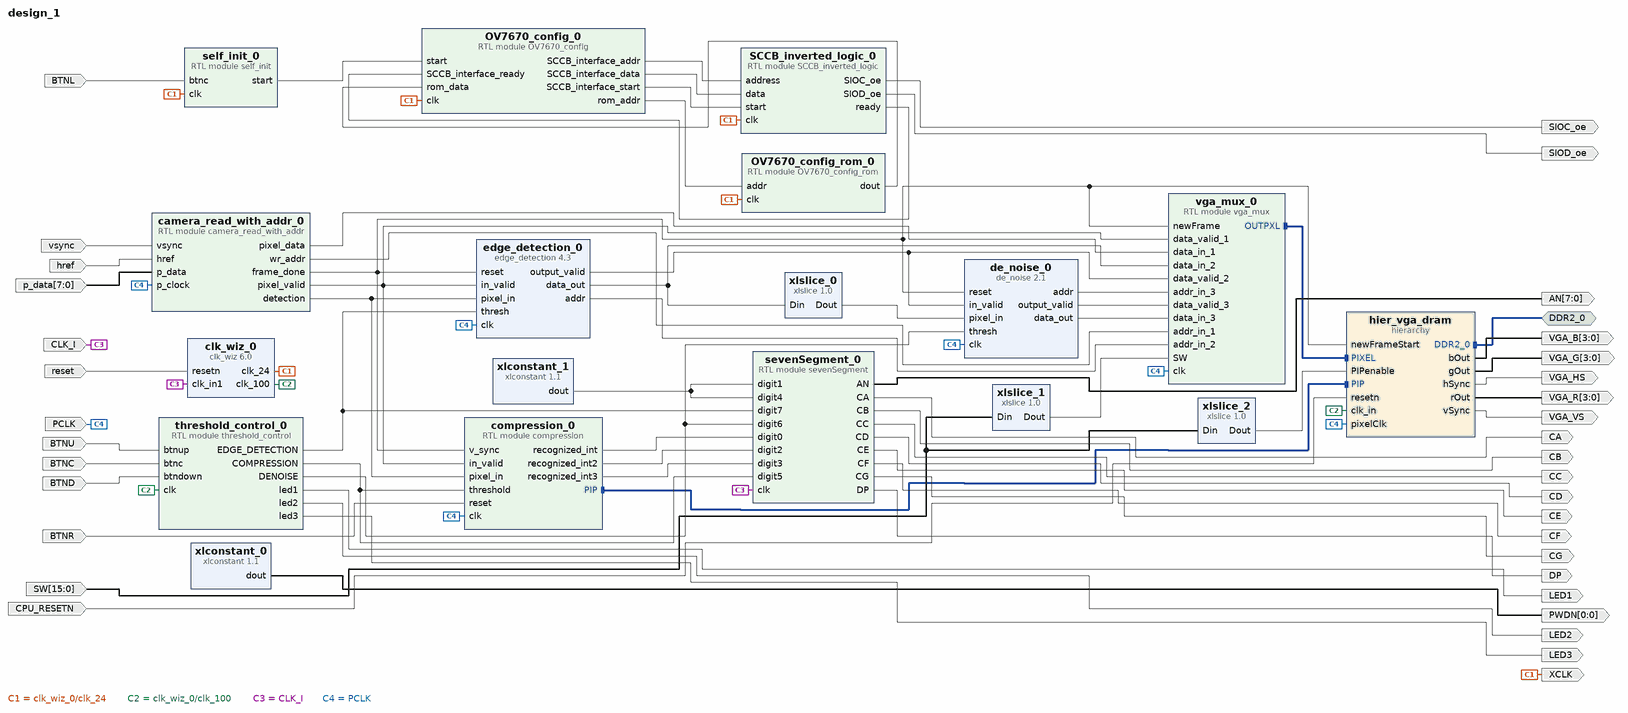
[diagram p0: block diagram of the top level]
# Vivado block design design_1, xc7a100tcsg324-1, Vivado 2018.3
create_bd_design design_1

create_bd_intf_port -mode Master -vlnv xilinx.com:interface:ddrx_rtl:1.0 DDR2_0
create_bd_port -dir O SIOC_oe
create_bd_port -dir O SIOD_oe
create_bd_port -dir I -type clk PCLK
set_property -dict {CONFIG.FREQ_HZ 24000000} [get_bd_ports PCLK]
create_bd_port -dir I vsync
create_bd_port -dir I href
create_bd_port -dir I -from 7 -to 0 p_data
create_bd_port -dir I -type rst reset
set_property -dict {CONFIG.POLARITY ACTIVE_LOW} [get_bd_ports reset]
create_bd_port -dir O -type clk XCLK
create_bd_port -dir O -from 0 -to 0 PWDN
create_bd_port -dir I -type clk CLK_I
set_property -dict {CONFIG.ASSOCIATED_RESET CPU_RESETN CONFIG.FREQ_HZ 100000000 CONFIG.PHASE 0.000} [get_bd_ports CLK_I]
create_bd_port -dir O -from 3 -to 0 VGA_B
create_bd_port -dir O -from 3 -to 0 VGA_G
create_bd_port -dir O -from 3 -to 0 VGA_R
create_bd_port -dir O VGA_VS
create_bd_port -dir O VGA_HS
create_bd_port -dir I -from 15 -to 0 SW
create_bd_port -dir I BTNL
create_bd_port -dir I -type rst BTNR
create_bd_port -dir O -from 7 -to 0 AN
create_bd_port -dir O CA
create_bd_port -dir O CB
create_bd_port -dir O CC
create_bd_port -dir O CD
create_bd_port -dir O CE
create_bd_port -dir O CF
create_bd_port -dir O CG
create_bd_port -dir O DP
create_bd_port -dir I CPU_RESETN
create_bd_port -dir I BTNU
create_bd_port -dir I BTNC
create_bd_port -dir I BTND
create_bd_port -dir O LED1
create_bd_port -dir O LED2
create_bd_port -dir O LED3

create_bd_cell -type ip -vlnv xilinx.com:ip:xlconstant:1.1 xlconstant_0
set_property -dict {CONFIG.CONST_VAL 0 CONFIG.CONST_WIDTH 1} [get_bd_cells xlconstant_0]
create_bd_cell -type module -reference SCCB_inverted_logic SCCB_inverted_logic_0
set_property -dict {CONFIG.CLK_FREQ 24000000} [get_bd_cells SCCB_inverted_logic_0]
create_bd_cell -type module -reference self_init self_init_0
create_bd_cell -type ip -vlnv xilinx.com:ip:xlconstant:1.1 xlconstant_1
set_property -dict {CONFIG.CONST_VAL b11111 CONFIG.CONST_WIDTH 5} [get_bd_cells xlconstant_1]
create_bd_cell -type hier hier_vga_dram
create_bd_cell -type ip -vlnv xilinx.com:ip:clk_wiz:6.0 clk_wiz_0
set_property -dict [list \
  CONFIG.CLKOUT1_JITTER 184.947 \
  CONFIG.CLKOUT1_PHASE_ERROR 105.461 \
  CONFIG.CLKOUT1_REQUESTED_OUT_FREQ 24 \
  CONFIG.CLKOUT1_USED true \
  CONFIG.CLKOUT2_JITTER 137.681 \
  CONFIG.CLKOUT2_PHASE_ERROR 105.461 \
  CONFIG.CLKOUT2_REQUESTED_OUT_FREQ 100 \
  CONFIG.CLKOUT2_USED true \
  CONFIG.CLKOUT3_JITTER 200.470 \
  CONFIG.CLKOUT3_PHASE_ERROR 132.063 \
  CONFIG.CLKOUT3_REQUESTED_OUT_FREQ 25 \
  CONFIG.CLKOUT3_USED false \
  CONFIG.CLK_OUT1_PORT clk_24 \
  CONFIG.CLK_OUT2_PORT clk_100 \
  CONFIG.MMCM_CLKFBOUT_MULT_F 9.000 \
  CONFIG.MMCM_CLKIN1_PERIOD 10.000 \
  CONFIG.MMCM_CLKIN2_PERIOD 10.000 \
  CONFIG.MMCM_CLKOUT0_DIVIDE_F 37.500 \
  CONFIG.MMCM_CLKOUT1_DIVIDE 9 \
  CONFIG.MMCM_CLKOUT2_DIVIDE 1 \
  CONFIG.MMCM_DIVCLK_DIVIDE 1 \
  CONFIG.NUM_OUT_CLKS 2 \
  CONFIG.RESET_PORT resetn \
  CONFIG.RESET_TYPE ACTIVE_LOW \
  CONFIG.USE_LOCKED false \
  CONFIG.USE_RESET true \
] [get_bd_cells clk_wiz_0]
create_bd_cell -type ip -vlnv xilinx.com:ip:xlslice:1.0 xlslice_1
set_property -dict {CONFIG.DIN_FROM 1 CONFIG.DIN_TO 0 CONFIG.DIN_WIDTH 16 CONFIG.DOUT_WIDTH 2} [get_bd_cells xlslice_1]
create_bd_cell -type ip -vlnv xilinx.com:ip:xlslice:1.0 xlslice_2
set_property -dict {CONFIG.DIN_FROM 15 CONFIG.DIN_TO 15 CONFIG.DIN_WIDTH 16 CONFIG.DOUT_WIDTH 1} [get_bd_cells xlslice_2]
create_bd_cell -type module -reference OV7670_config OV7670_config_0
set_property -dict {CONFIG.CLK_FREQ 24000000} [get_bd_cells OV7670_config_0]
create_bd_cell -type module -reference camera_read_with_addr camera_read_with_addr_0
create_bd_cell -type module -reference OV7670_config_rom OV7670_config_rom_0
create_bd_cell -type ip -vlnv xilinx.com:user:edge_detection:4.3 edge_detection_0
create_bd_cell -type ip -vlnv xilinx.com:user:de_noise:2.1 de_noise_0
create_bd_cell -type ip -vlnv xilinx.com:ip:xlslice:1.0 xlslice_0
set_property -dict {CONFIG.DIN_FROM 3 CONFIG.DIN_TO 0 CONFIG.DIN_WIDTH 12 CONFIG.DOUT_WIDTH 4} [get_bd_cells xlslice_0]
create_bd_cell -type module -reference compression compression_0
create_bd_cell -type module -reference threshold_control threshold_control_0
create_bd_cell -type module -reference vga_mux vga_mux_0
create_bd_cell -type module -reference sevenSegment sevenSegment_0
set_property -dict {CONFIG.CLOCK_DIVISION 100000} [get_bd_cells sevenSegment_0]

# ---- hierarchy /hier_vga_dram ----
current_bd_instance /hier_vga_dram
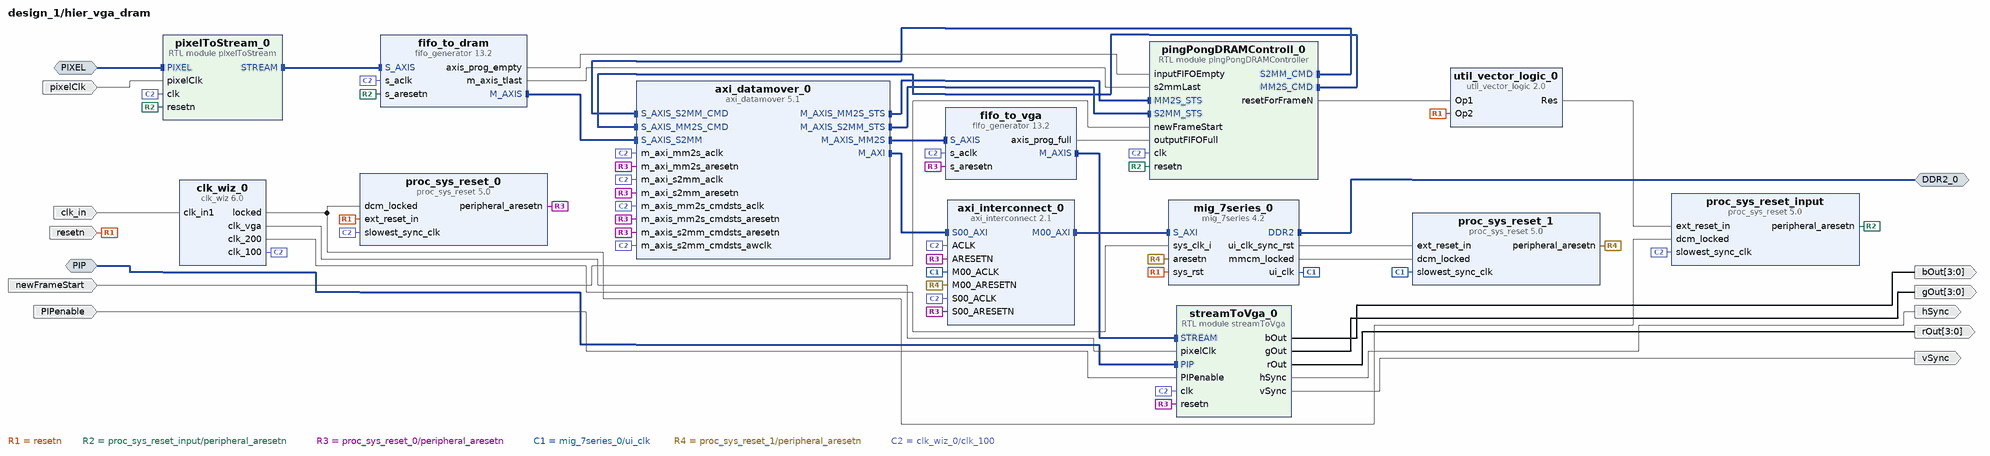
[diagram p1: block diagram inside /hier_vga_dram]
create_bd_intf_pin -mode Master -vlnv xilinx.com:interface:ddrx_rtl:1.0 DDR2_0
create_bd_intf_pin -mode Slave -vlnv xilinx.com:interface:bram_rtl:1.0 PIP
create_bd_intf_pin -mode Slave -vlnv xilinx.com:interface:bram_rtl:1.0 PIXEL
create_bd_pin -dir I PIPenable
create_bd_pin -dir I -type clk clk_in
create_bd_pin -dir I resetn
create_bd_pin -dir I pixelClk
create_bd_pin -dir I newFrameStart
create_bd_pin -dir O -from 3 -to 0 bOut
create_bd_pin -dir O -from 3 -to 0 gOut
create_bd_pin -dir O -from 3 -to 0 rOut
create_bd_pin -dir O vSync
create_bd_pin -dir O hSync

create_bd_cell -type ip -vlnv xilinx.com:ip:axi_datamover:5.1 axi_datamover_0
set_property -dict [list \
  CONFIG.c_dummy 0 \
  CONFIG.c_m_axi_mm2s_data_width 64 \
  CONFIG.c_m_axi_s2mm_data_width 64 \
  CONFIG.c_m_axis_mm2s_tdata_width 64 \
  CONFIG.c_mm2s_burst_size 8 \
  CONFIG.c_mm2s_include_sf false \
  CONFIG.c_s2mm_burst_size 8 \
  CONFIG.c_s_axis_s2mm_tdata_width 64 \
  CONFIG.c_single_interface 1 \
] [get_bd_cells axi_datamover_0]
create_bd_cell -type ip -vlnv xilinx.com:ip:fifo_generator:13.2 fifo_to_dram
set_property -dict [list \
  CONFIG.Empty_Threshold_Assert_Value_axis 7 \
  CONFIG.Enable_Safety_Circuit true \
  CONFIG.Enable_TLAST true \
  CONFIG.FIFO_Implementation_rach Common_Clock_Distributed_RAM \
  CONFIG.FIFO_Implementation_wach Common_Clock_Distributed_RAM \
  CONFIG.FIFO_Implementation_wrch Common_Clock_Distributed_RAM \
  CONFIG.Full_Flags_Reset_Value 1 \
  CONFIG.INTERFACE_TYPE AXI_STREAM \
  CONFIG.Input_Depth_axis 512 \
  CONFIG.Programmable_Empty_Type_axis Single_Programmable_Empty_Threshold_Constant \
  CONFIG.TDATA_NUM_BYTES 8 \
  CONFIG.TUSER_WIDTH 0 \
] [get_bd_cells fifo_to_dram]
create_bd_cell -type ip -vlnv xilinx.com:ip:fifo_generator:13.2 fifo_to_vga
set_property -dict [list \
  CONFIG.Enable_Safety_Circuit true \
  CONFIG.Enable_TLAST true \
  CONFIG.FIFO_Implementation_rach Common_Clock_Distributed_RAM \
  CONFIG.FIFO_Implementation_wach Common_Clock_Distributed_RAM \
  CONFIG.FIFO_Implementation_wrch Common_Clock_Distributed_RAM \
  CONFIG.Full_Flags_Reset_Value 1 \
  CONFIG.Full_Threshold_Assert_Value_axis 57 \
  CONFIG.INTERFACE_TYPE AXI_STREAM \
  CONFIG.Input_Depth_axis 64 \
  CONFIG.Programmable_Empty_Type_axis No_Programmable_Empty_Threshold \
  CONFIG.Programmable_Full_Type_axis Single_Programmable_Full_Threshold_Constant \
  CONFIG.TDATA_NUM_BYTES 8 \
  CONFIG.TUSER_WIDTH 0 \
] [get_bd_cells fifo_to_vga]
create_bd_cell -type ip -vlnv xilinx.com:ip:util_vector_logic:2.0 util_vector_logic_0
set_property -dict {CONFIG.C_SIZE 1} [get_bd_cells util_vector_logic_0]
create_bd_cell -type ip -vlnv xilinx.com:ip:clk_wiz:6.0 clk_wiz_0
set_property -dict [list \
  CONFIG.CLKOUT1_JITTER 191.399 \
  CONFIG.CLKOUT1_PHASE_ERROR 114.212 \
  CONFIG.CLKOUT1_REQUESTED_OUT_FREQ 25.2 \
  CONFIG.CLKOUT2_JITTER 126.455 \
  CONFIG.CLKOUT2_PHASE_ERROR 114.212 \
  CONFIG.CLKOUT2_REQUESTED_OUT_FREQ 200 \
  CONFIG.CLKOUT2_USED true \
  CONFIG.CLKOUT3_JITTER 144.719 \
  CONFIG.CLKOUT3_PHASE_ERROR 114.212 \
  CONFIG.CLKOUT3_REQUESTED_OUT_FREQ 100 \
  CONFIG.CLKOUT3_USED true \
  CONFIG.CLK_OUT1_PORT clk_vga \
  CONFIG.CLK_OUT2_PORT clk_200 \
  CONFIG.CLK_OUT3_PORT clk_100 \
  CONFIG.MMCM_CLKFBOUT_MULT_F 8.000 \
  CONFIG.MMCM_CLKOUT0_DIVIDE_F 31.750 \
  CONFIG.MMCM_CLKOUT1_DIVIDE 4 \
  CONFIG.MMCM_CLKOUT2_DIVIDE 8 \
  CONFIG.MMCM_DIVCLK_DIVIDE 1 \
  CONFIG.NUM_OUT_CLKS 3 \
  CONFIG.USE_RESET false \
] [get_bd_cells clk_wiz_0]
create_bd_cell -type ip -vlnv xilinx.com:ip:proc_sys_reset:5.0 proc_sys_reset_input
create_bd_cell -type ip -vlnv xilinx.com:ip:proc_sys_reset:5.0 proc_sys_reset_0
create_bd_cell -type ip -vlnv xilinx.com:ip:axi_interconnect:2.1 axi_interconnect_0
set_property -dict {CONFIG.NUM_MI 1} [get_bd_cells axi_interconnect_0]
create_bd_cell -type ip -vlnv xilinx.com:ip:mig_7series:4.2 mig_7series_0
create_bd_cell -type ip -vlnv xilinx.com:ip:proc_sys_reset:5.0 proc_sys_reset_1
create_bd_cell -type module -reference pingPongDRAMController pingPongDRAMControll_0
set_property -dict {CONFIG.ADDRESS_PONG 0x82000000 CONFIG.BYTES_PER_TRANSFER 64} [get_bd_cells pingPongDRAMControll_0]
create_bd_cell -type module -reference pixelToStream pixelToStream_0
set_property -dict {CONFIG.PACKETS_TO_APPEND 0 CONFIG.STREAM_WIDTH 64} [get_bd_cells pixelToStream_0]
create_bd_cell -type module -reference streamToVga streamToVga_0
set_property -dict {CONFIG.PIP_SCALE 4 CONFIG.STREAM_WIDTH 64} [get_bd_cells streamToVga_0]

# ---- connections ----

current_bd_instance /hier_vga_dram
connect_bd_intf_net [get_bd_intf_pins DDR2_0] [get_bd_intf_pins mig_7series_0/DDR2]
connect_bd_intf_net [get_bd_intf_pins axi_interconnect_0/M00_AXI] [get_bd_intf_pins mig_7series_0/S_AXI]
connect_bd_intf_net [get_bd_intf_pins axi_datamover_0/M_AXIS_MM2S] [get_bd_intf_pins fifo_to_vga/S_AXIS]
connect_bd_intf_net [get_bd_intf_pins pingPongDRAMControll_0/MM2S_STS] [get_bd_intf_pins axi_datamover_0/M_AXIS_MM2S_STS]
connect_bd_intf_net [get_bd_intf_pins pingPongDRAMControll_0/S2MM_CMD] [get_bd_intf_pins axi_datamover_0/S_AXIS_S2MM_CMD]
connect_bd_intf_net [get_bd_intf_pins fifo_to_dram/M_AXIS] [get_bd_intf_pins axi_datamover_0/S_AXIS_S2MM]
connect_bd_intf_net [get_bd_intf_pins axi_interconnect_0/S00_AXI] [get_bd_intf_pins axi_datamover_0/M_AXI]
connect_bd_intf_net [get_bd_intf_pins pingPongDRAMControll_0/MM2S_CMD] [get_bd_intf_pins axi_datamover_0/S_AXIS_MM2S_CMD]
connect_bd_intf_net [get_bd_intf_pins axi_datamover_0/M_AXIS_S2MM_STS] [get_bd_intf_pins pingPongDRAMControll_0/S2MM_STS]
connect_bd_intf_net [get_bd_intf_pins PIP] [get_bd_intf_pins streamToVga_0/PIP]
connect_bd_intf_net [get_bd_intf_pins PIXEL] [get_bd_intf_pins pixelToStream_0/PIXEL]
connect_bd_intf_net [get_bd_intf_pins fifo_to_vga/M_AXIS] [get_bd_intf_pins streamToVga_0/STREAM]
connect_bd_intf_net [get_bd_intf_pins pixelToStream_0/STREAM] [get_bd_intf_pins fifo_to_dram/S_AXIS]
connect_bd_net -net PIPenable_0_1 [get_bd_pins PIPenable] [get_bd_pins streamToVga_0/PIPenable]
connect_bd_net [get_bd_pins fifo_to_vga/axis_prog_full] [get_bd_pins pingPongDRAMControll_0/outputFIFOFull]
connect_bd_net [get_bd_pins resetn] \
  [get_bd_pins util_vector_logic_0/Op2] [get_bd_pins proc_sys_reset_0/ext_reset_in] [get_bd_pins mig_7series_0/sys_rst]
connect_bd_net -net pixelClk_0_1 [get_bd_pins pixelClk] [get_bd_pins pixelToStream_0/pixelClk]
connect_bd_net [get_bd_pins clk_wiz_0/clk_vga] [get_bd_pins streamToVga_0/pixelClk]
connect_bd_net [get_bd_pins pingPongDRAMControll_0/resetForFrameN] [get_bd_pins util_vector_logic_0/Op1]
connect_bd_net -net newFrameStart_0_1 [get_bd_pins newFrameStart] [get_bd_pins pingPongDRAMControll_0/newFrameStart]
connect_bd_net [get_bd_pins clk_wiz_0/locked] [get_bd_pins proc_sys_reset_input/dcm_locked] [get_bd_pins proc_sys_reset_0/dcm_locked]
connect_bd_net -net resetn_for_frame [get_bd_pins proc_sys_reset_input/peripheral_aresetn] \
  [get_bd_pins fifo_to_dram/s_aresetn] [get_bd_pins pingPongDRAMControll_0/resetn] [get_bd_pins pixelToStream_0/resetn]
connect_bd_net [get_bd_pins proc_sys_reset_0/peripheral_aresetn] \
  [get_bd_pins axi_datamover_0/m_axi_mm2s_aresetn] [get_bd_pins axi_datamover_0/m_axis_mm2s_cmdsts_aresetn] \
  [get_bd_pins axi_datamover_0/m_axi_s2mm_aresetn] [get_bd_pins axi_datamover_0/m_axis_s2mm_cmdsts_aresetn] \
  [get_bd_pins fifo_to_vga/s_aresetn] [get_bd_pins axi_interconnect_0/ARESETN] [get_bd_pins axi_interconnect_0/S00_ARESETN] \
  [get_bd_pins streamToVga_0/resetn]
connect_bd_net -net M00_ACLK_1 [get_bd_pins mig_7series_0/ui_clk] \
  [get_bd_pins proc_sys_reset_1/slowest_sync_clk] [get_bd_pins axi_interconnect_0/M00_ACLK]
connect_bd_net [get_bd_pins mig_7series_0/ui_clk_sync_rst] [get_bd_pins proc_sys_reset_1/ext_reset_in]
connect_bd_net [get_bd_pins mig_7series_0/mmcm_locked] [get_bd_pins proc_sys_reset_1/dcm_locked]
connect_bd_net [get_bd_pins proc_sys_reset_1/peripheral_aresetn] [get_bd_pins mig_7series_0/aresetn] [get_bd_pins axi_interconnect_0/M00_ARESETN]
connect_bd_net [get_bd_pins util_vector_logic_0/Res] [get_bd_pins proc_sys_reset_input/ext_reset_in]
connect_bd_net [get_bd_pins fifo_to_dram/axis_prog_empty] [get_bd_pins pingPongDRAMControll_0/inputFIFOEmpty]
connect_bd_net [get_bd_pins fifo_to_dram/m_axis_tlast] [get_bd_pins pingPongDRAMControll_0/s2mmLast]
connect_bd_net [get_bd_pins clk_wiz_0/clk_200] [get_bd_pins mig_7series_0/sys_clk_i]
connect_bd_net [get_bd_pins clk_wiz_0/clk_100] \
  [get_bd_pins fifo_to_vga/s_aclk] [get_bd_pins fifo_to_dram/s_aclk] [get_bd_pins axi_datamover_0/m_axi_mm2s_aclk] \
  [get_bd_pins axi_datamover_0/m_axis_mm2s_cmdsts_aclk] [get_bd_pins axi_datamover_0/m_axi_s2mm_aclk] \
  [get_bd_pins axi_datamover_0/m_axis_s2mm_cmdsts_awclk] [get_bd_pins proc_sys_reset_input/slowest_sync_clk] \
  [get_bd_pins proc_sys_reset_0/slowest_sync_clk] [get_bd_pins axi_interconnect_0/S00_ACLK] \
  [get_bd_pins axi_interconnect_0/ACLK] [get_bd_pins pingPongDRAMControll_0/clk] [get_bd_pins pixelToStream_0/clk] \
  [get_bd_pins streamToVga_0/clk]
connect_bd_net [get_bd_pins clk_in] [get_bd_pins clk_wiz_0/clk_in1]
connect_bd_net [get_bd_pins streamToVga_0/bOut] [get_bd_pins bOut]
connect_bd_net [get_bd_pins streamToVga_0/gOut] [get_bd_pins gOut]
connect_bd_net [get_bd_pins streamToVga_0/rOut] [get_bd_pins rOut]
connect_bd_net [get_bd_pins streamToVga_0/vSync] [get_bd_pins vSync]
connect_bd_net [get_bd_pins streamToVga_0/hSync] [get_bd_pins hSync]

current_bd_instance /
connect_bd_intf_net [get_bd_intf_pins compression_0/PIP] [get_bd_intf_pins hier_vga_dram/PIP]
connect_bd_intf_net [get_bd_intf_ports DDR2_0] [get_bd_intf_pins hier_vga_dram/DDR2_0]
connect_bd_intf_net [get_bd_intf_pins vga_mux_0/OUTPXL] [get_bd_intf_pins hier_vga_dram/PIXEL]
connect_bd_net -net design_1_0_SIOC_oe [get_bd_pins SCCB_inverted_logic_0/SIOC_oe] [get_bd_ports SIOC_oe]
connect_bd_net -net design_1_0_SIOD_oe [get_bd_pins SCCB_inverted_logic_0/SIOD_oe] [get_bd_ports SIOD_oe]
connect_bd_net [get_bd_ports vsync] [get_bd_pins camera_read_with_addr_0/vsync]
connect_bd_net [get_bd_ports href] [get_bd_pins camera_read_with_addr_0/href]
connect_bd_net [get_bd_ports p_data] [get_bd_pins camera_read_with_addr_0/p_data]
connect_bd_net [get_bd_pins xlconstant_0/dout] [get_bd_ports PWDN]
connect_bd_net [get_bd_pins camera_read_with_addr_0/frame_done] \
  [get_bd_pins hier_vga_dram/newFrameStart] [get_bd_pins edge_detection_0/reset] [get_bd_pins de_noise_0/reset] \
  [get_bd_pins compression_0/v_sync] [get_bd_pins vga_mux_0/newFrame]
connect_bd_net [get_bd_pins OV7670_config_0/SCCB_interface_addr] [get_bd_pins SCCB_inverted_logic_0/address]
connect_bd_net [get_bd_pins OV7670_config_0/SCCB_interface_data] [get_bd_pins SCCB_inverted_logic_0/data]
connect_bd_net [get_bd_pins OV7670_config_0/SCCB_interface_start] [get_bd_pins SCCB_inverted_logic_0/start]
connect_bd_net [get_bd_pins OV7670_config_rom_0/dout] [get_bd_pins OV7670_config_0/rom_data]
connect_bd_net [get_bd_pins OV7670_config_0/rom_addr] [get_bd_pins OV7670_config_rom_0/addr]
connect_bd_net [get_bd_pins SCCB_inverted_logic_0/ready] [get_bd_pins OV7670_config_0/SCCB_interface_ready]
connect_bd_net [get_bd_pins camera_read_with_addr_0/pixel_valid] \
  [get_bd_pins edge_detection_0/in_valid] [get_bd_pins compression_0/in_valid] [get_bd_pins vga_mux_0/data_valid_1]
connect_bd_net [get_bd_pins self_init_0/start] [get_bd_pins OV7670_config_0/start]
connect_bd_net -net btnc_0_1 [get_bd_ports BTNL] [get_bd_pins self_init_0/btnc]
connect_bd_net [get_bd_pins sevenSegment_0/AN] [get_bd_ports AN]
connect_bd_net [get_bd_pins sevenSegment_0/CA] [get_bd_ports CA]
connect_bd_net [get_bd_pins sevenSegment_0/CB] [get_bd_ports CB]
connect_bd_net [get_bd_pins sevenSegment_0/CC] [get_bd_ports CC]
connect_bd_net [get_bd_pins sevenSegment_0/CD] [get_bd_ports CD]
connect_bd_net [get_bd_pins sevenSegment_0/CE] [get_bd_ports CE]
connect_bd_net [get_bd_pins sevenSegment_0/CF] [get_bd_ports CF]
connect_bd_net [get_bd_pins sevenSegment_0/CG] [get_bd_ports CG]
connect_bd_net [get_bd_pins sevenSegment_0/DP] [get_bd_ports DP]
connect_bd_net [get_bd_pins xlconstant_1/dout] [get_bd_pins sevenSegment_0/digit1] [get_bd_pins sevenSegment_0/digit4]
connect_bd_net [get_bd_pins clk_wiz_0/clk_24] \
  [get_bd_ports XCLK] [get_bd_pins SCCB_inverted_logic_0/clk] [get_bd_pins self_init_0/clk] [get_bd_pins OV7670_config_0/clk] \
  [get_bd_pins OV7670_config_rom_0/clk]
connect_bd_net [get_bd_pins xlslice_1/Dout] [get_bd_pins vga_mux_0/SW]
connect_bd_net [get_bd_ports SW] [get_bd_pins xlslice_1/Din] [get_bd_pins xlslice_2/Din]
connect_bd_net -net PIPenable_1 [get_bd_pins xlslice_2/Dout] [get_bd_pins hier_vga_dram/PIPenable]
connect_bd_net -net resetn_0_1 [get_bd_ports CPU_RESETN] [get_bd_pins hier_vga_dram/resetn]
connect_bd_net [get_bd_pins clk_wiz_0/clk_100] [get_bd_pins hier_vga_dram/clk_in] [get_bd_pins threshold_control_0/clk]
connect_bd_net [get_bd_ports CLK_I] [get_bd_pins clk_wiz_0/clk_in1] [get_bd_pins sevenSegment_0/clk]
connect_bd_net [get_bd_ports PCLK] \
  [get_bd_pins camera_read_with_addr_0/p_clock] [get_bd_pins hier_vga_dram/pixelClk] [get_bd_pins edge_detection_0/clk] \
  [get_bd_pins de_noise_0/clk] [get_bd_pins compression_0/clk] [get_bd_pins vga_mux_0/clk]
connect_bd_net [get_bd_pins camera_read_with_addr_0/pixel_data] [get_bd_pins vga_mux_0/data_in_1]
connect_bd_net [get_bd_pins camera_read_with_addr_0/wr_addr] [get_bd_pins vga_mux_0/addr_in_1]
connect_bd_net [get_bd_ports reset] [get_bd_pins clk_wiz_0/resetn]
connect_bd_net [get_bd_pins camera_read_with_addr_0/detection] [get_bd_pins edge_detection_0/pixel_in] [get_bd_pins compression_0/pixel_in]
connect_bd_net [get_bd_ports BTNR] [get_bd_pins compression_0/reset]
connect_bd_net [get_bd_pins compression_0/recognized_int] [get_bd_pins sevenSegment_0/digit0]
connect_bd_net [get_bd_pins compression_0/recognized_int2] [get_bd_pins sevenSegment_0/digit2]
connect_bd_net [get_bd_pins compression_0/recognized_int3] [get_bd_pins sevenSegment_0/digit3]
connect_bd_net -net btnup_0_1 [get_bd_ports BTNU] [get_bd_pins threshold_control_0/btnup]
connect_bd_net -net btnc_0_2 [get_bd_ports BTNC] [get_bd_pins threshold_control_0/btnc]
connect_bd_net -net btndown_0_1 [get_bd_ports BTND] [get_bd_pins threshold_control_0/btndown]
connect_bd_net [get_bd_pins threshold_control_0/COMPRESSION] [get_bd_pins compression_0/threshold] [get_bd_pins sevenSegment_0/digit5]
connect_bd_net [get_bd_pins threshold_control_0/led1] [get_bd_ports LED1]
connect_bd_net [get_bd_pins threshold_control_0/led2] [get_bd_ports LED2]
connect_bd_net [get_bd_pins threshold_control_0/led3] [get_bd_ports LED3]
connect_bd_net [get_bd_pins threshold_control_0/EDGE_DETECTION] [get_bd_pins edge_detection_0/thresh] [get_bd_pins sevenSegment_0/digit7]
connect_bd_net [get_bd_pins threshold_control_0/DENOISE] [get_bd_pins de_noise_0/thresh] [get_bd_pins sevenSegment_0/digit6]
connect_bd_net [get_bd_pins edge_detection_0/data_out] [get_bd_pins xlslice_0/Din] [get_bd_pins vga_mux_0/data_in_2]
connect_bd_net [get_bd_pins edge_detection_0/output_valid] [get_bd_pins de_noise_0/in_valid] [get_bd_pins vga_mux_0/data_valid_2]
connect_bd_net [get_bd_pins edge_detection_0/addr] [get_bd_pins vga_mux_0/addr_in_2]
connect_bd_net [get_bd_pins xlslice_0/Dout] [get_bd_pins de_noise_0/pixel_in]
connect_bd_net [get_bd_pins de_noise_0/addr] [get_bd_pins vga_mux_0/addr_in_3]
connect_bd_net [get_bd_pins de_noise_0/output_valid] [get_bd_pins vga_mux_0/data_valid_3]
connect_bd_net [get_bd_pins de_noise_0/data_out] [get_bd_pins vga_mux_0/data_in_3]
connect_bd_net [get_bd_pins hier_vga_dram/bOut] [get_bd_ports VGA_B]
connect_bd_net [get_bd_pins hier_vga_dram/gOut] [get_bd_ports VGA_G]
connect_bd_net [get_bd_pins hier_vga_dram/rOut] [get_bd_ports VGA_R]
connect_bd_net [get_bd_pins hier_vga_dram/vSync] [get_bd_ports VGA_VS]
connect_bd_net [get_bd_pins hier_vga_dram/hSync] [get_bd_ports VGA_HS]

# ---- address map ----
assign_bd_address -offset 0x80000000 -range 128M -target_address_space [get_bd_addr_spaces hier_vga_dram/axi_datamover_0/Data] [get_bd_addr_segs hier_vga_dram/mig_7series_0/memmap/memaddr]

set_property USER_COMMENTS.comment_4 {Massive input buffer to deal with potential for the frames in and out to have their
blanking periods go out of sync. This might cause some pixels to be lost since the
input from the camera does not respect any back-pressure.

Needed to cover potentially 45 lines, so a depth of 3600 is needed.
640*2 (bytes per row) * 45 (blanking rows) / 2 (relative frequency of output to input) * 8 (byte witdh)} [current_bd_design]
set_property USER_COMMENTS.comment_5 {With better control over the output,
the buffer can be quite small} [current_bd_design]
set_property USER_COMMENTS.comment_4 {Massive input buffer to deal with potential for the frames in and out to have their
blanking periods go out of sync. This might cause some pixels to be lost since the
input from the camera does not respect any back-pressure.

Needed to cover potentially 45 lines, so a depth of 3600 is needed.
640*2 (bytes per row) * 45 (blanking rows) / 2 (relative frequency of output to input) * 8 (byte witdh)} [get_bd_cells /hier_vga_dram]
set_property USER_COMMENTS.comment_5 {With better control over the output,
the buffer can be quite small} [get_bd_cells /hier_vga_dram]

validate_bd_design
save_bd_design
